# EAGLE design ChronoDot (EAGLE 5.10)
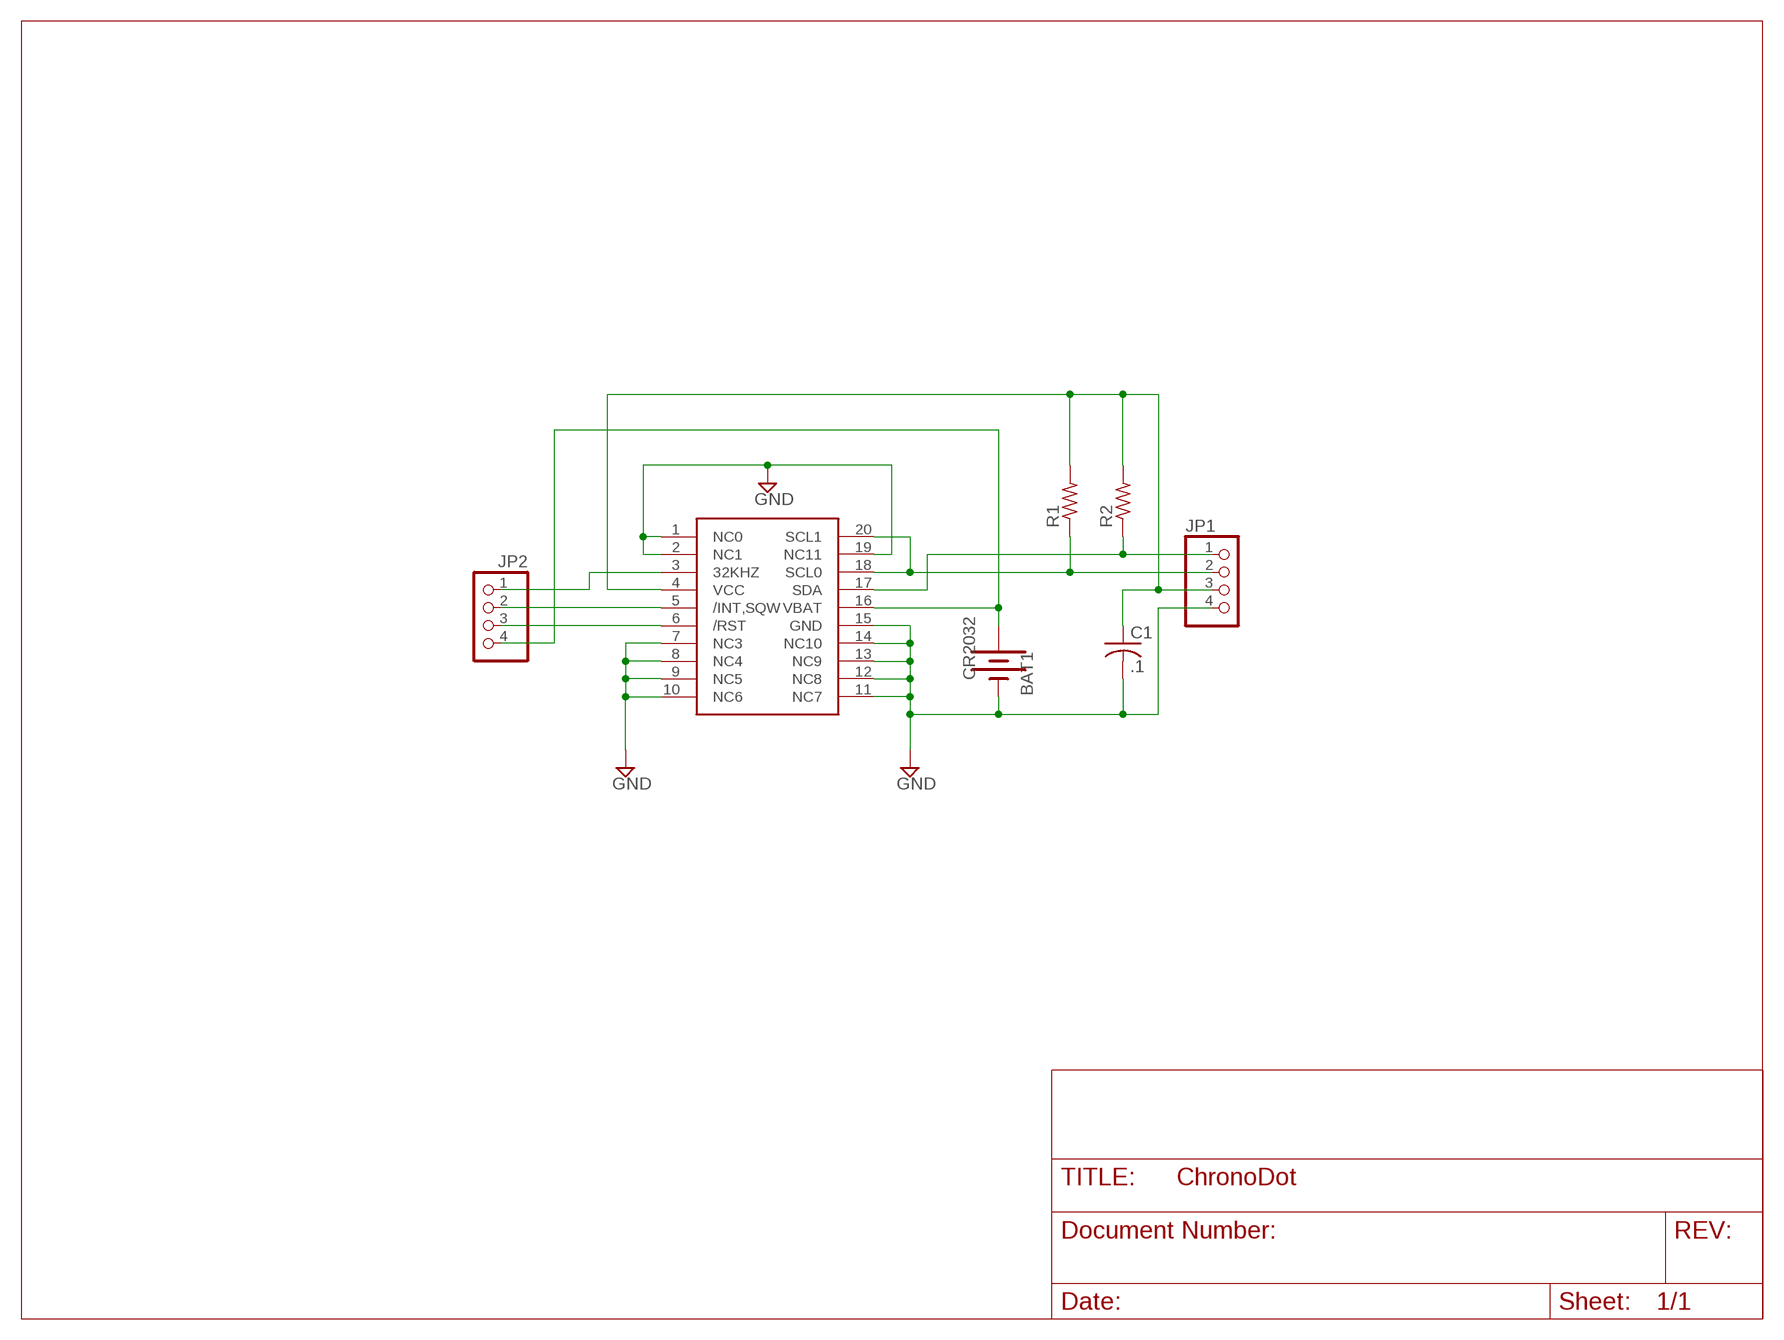
[diagram p0: schematic, sheet 1]

## Parts
BAT1  CR2032  BATTERY  [BATTCOM_20MM_PTH_3]
C1  .1  C-USC0805  [C0805]
IC1  DS3232  [SO20W]
JP1  PINHD-1X4  [1X04]
JP2  PINHD-1X4  [1X04]
R1  R-US_0204/5  [0204/5]
R2  R-US_0204/5  [0204/5]

## Nets
FOO: C1.1 IC1.4(VCC) JP1.3 R1.2 R2.2
GND: BAT1.2(-) C1.2 IC1.1(NC0) IC1.2(NC1) IC1.7(NC3) IC1.8(NC4) IC1.9(NC5) IC1.10(NC6) IC1.11(NC7) IC1.12(NC8) IC1.13(NC9) IC1.14(NC10) IC1.15(GND) IC1.19(NC11) JP1.4
N$1: IC1.5(/INT,SQW) JP2.2
N$2: IC1.3(32KHZ) JP2.1
N$3: IC1.6(/RST) JP2.3
N$7: IC1.17(SDA) JP1.1 R2.1
N$8: IC1.18(SCL0) IC1.20(SCL1) JP1.2 R1.1
VBAT: BAT1.1(+) IC1.16(VBAT) JP2.4

## Library data of the parts
BAT1 = ideabot:BATTERY: Battery Holders Various common sizes : AA, AAA, 20mm coin cell and 12mm coin cell.
C1 = rcl:C-US: CAPACITOR, American symbol
IC1 = ideabot:DS3232
JP1 JP2 = pinhead:PINHD-1X4: PIN HEADER
R1 R2 = rcl:R-US_: RESISTOR, American symbol

## Board
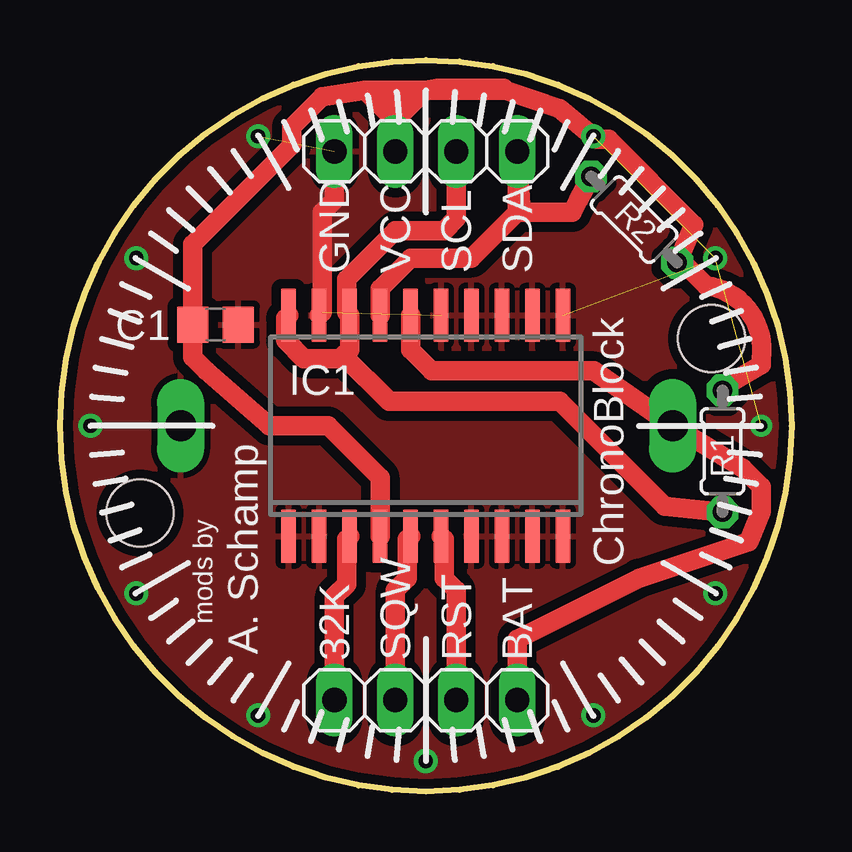
[diagram p1: board, top side]
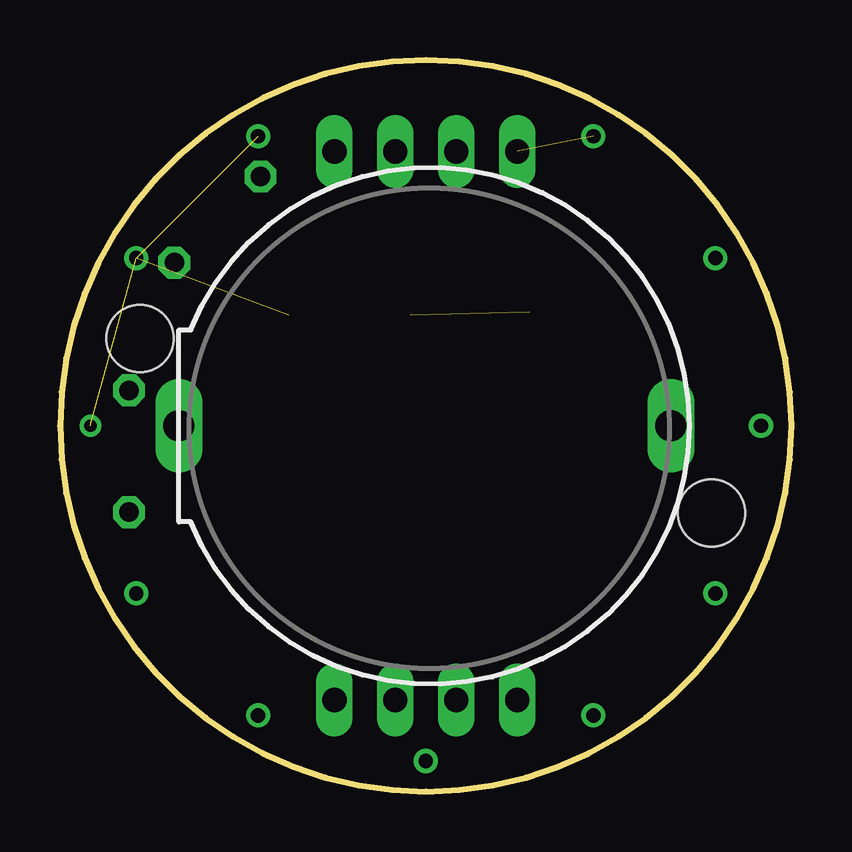
[diagram p2: board, bottom side, seen from below]

Size 30.48 x 30.48 mm. Coordinates in mm from the lower left corner, seen from the top.
Outline: 15.24,30.48 arc-90 30.48,15.24 arc-90 15.24,0 arc-90 0,15.24 arc-90 15.24,30.48
Copper layers (1*16): Top 0.035mm / dielectric 1.5mm / Bottom 0.035mm
Design rules "default *": minimum track width 10mil, minimum drill 24mil, track to track 8mil, track to pad 8mil, pad to pad 8mil, via to via 8mil, smd to smd 8mil, copper to edge 10mil, drill to drill 8mil, minimum pad ring 10mil, minimum via ring 8mil, stop-mask expansion 4mil, vias tented up to drill 0mil, thermal gap 10mil
Holes 2.8 mm at 27.14,18.88 3.34,11.6
bRestrict: 5 lines
Milling: 4 lines

### Footprints (pad centres in the part's own frame; a part is rotated, then mirrored left to right if it is on the bottom)
BATTCOM_20MM_PTH_3 = drill 1.3 long: 1 12,0; 2 -8.5,0
C0805 = smd 1.3 x 1.5: 1 -0.95,0; 2 0.95,0
SO20W = smd 0.6 x 2.2: 1 -5.715,-4.6; 2 -4.445,-4.6; 3 -3.175,-4.6; 4 -1.905,-4.6; 5 -0.635,-4.6; 6 0.635,-4.6; 7 1.905,-4.6; 8 3.175,-4.6; 9 4.445,-4.6; 10 5.715,-4.6; 11 5.715,4.6; 12 4.445,4.6; 13 3.175,4.6; 14 1.905,4.6; 15 0.635,4.6; 16 -0.635,4.6; 17 -1.905,4.6; 18 -3.175,4.6; 19 -4.445,4.6; 20 -5.715,4.6
1X04 = drill 1.016 long: 1 -3.81,0; 2 -1.27,0; 3 1.27,0; 4 3.81,0
0204/5 = drill 0.813 octagon: 1 -2.54,0; 2 2.54,0

### Placement (x,y rotation side)
BAT1  13.53,15.24 180 bottom
C1  6.48,19.46 0 top
IC1  15.24,15.24 0 top
JP1  15.24,26.67 180 top
JP2  15.24,3.81 0 top
R1  27.6,14.18 90 top
R2  23.92,23.83 315 top

### Tracks (layer width: path | path; a pad name or v marks a point on that pad's centre or on a via)
FOO
  Top 0.813: 13.97,27.94 15.24,29.21 15.75,29.3 18.45,29.3 arc-90 18.54,29.21 | 12.7,29.21 13.97,29.21 | 13.97,29.21 13.97,27.94 | 13.97,29.21 18.54,29.21 | 18.54,29.21 20.83,28.45 22.35,27.18 22.86,27.18 26.42,23.62 R2.2 25.97,22.03 26.92,21.08 arc-90 29.21,18.03 29.21,17.78 27.91,17.02 R1.2 | 13.97,27.94 JP1.3 | 12.7,29.21 13.97,27.94 | IC1.4 13.34,13.08 11.18,15.24 8.73,15.24 6.1,17.53 5.53,18.09 C1.1 5.53,22.8 9.65,26.92 9.65,27.69 10.92,28.96 12.7,29.21
GND  (via drill 0.51, 0.6)  (5 unrouted)
  Top 0.813: IC1.19 10.92,19.97 10.92,24.13 11.43,24.64 JP1.4
  other vias: 27.3,8.26 22.23,3.17 15.24,1.27 8.26,3.17 3.17,8.26 8.26,27.3 22.23,27.3 27.3,22.23 3.17,22.23 1.27,15.24 29.21,15.24
  pour Top (isolate 0.406): 15.24,30.48 arc-90 30.48,15.24 arc-90 15.24,0 arc-90 0,15.24 arc-90
N$1
  Top 0.813: JP2.2 13.97,8.38 14.48,8.89 14.48,10.51 IC1.5
N$2
  Top 0.813: JP2.1 11.43,8.13 11.94,8.64 11.94,10.51 IC1.3
N$3
  Top 0.813: JP2.3 16.51,8.38 16,8.89 16,10.51 IC1.6
N$7
  Top 0.813: R2.1 21.59,24.64 21.34,24.13 19.21,24.13 JP1.1 19.05,24.13 17.14,22.23 14.61,22.23 13.34,20.95 IC1.17
N$8
  Top 0.813: 11.81,18.16 11.68,18.03 10.16,18.03 9.4,18.8 9.4,19.71 IC1.20 | 11.81,18.16 12.06,18.41 IC1.18 11.94,19.97 11.94,21.34 13.97,23.37 16,23.37 16.51,23.88 JP1.2 | R1.1 25.19,11.89 20.83,16.26 13.72,16.26 11.81,18.16
VBAT
  Top 0.813: IC1.16 14.61,18.41 15.49,17.53 22.24,17.53 BAT1.1 28.45,13.46 29.21,12.7 29.21,11.68 28.7,10.41 24.13,8.89 19.05,6.35 JP2.4

### Text on the board
tNames: GND | VCC | SCL | SDA | ChronoBlock | mods by | A. Schamp | 32K | SQW | RST | BAT